# EAGLE design I2C LCD Backpack v28 (EAGLE 6.1)
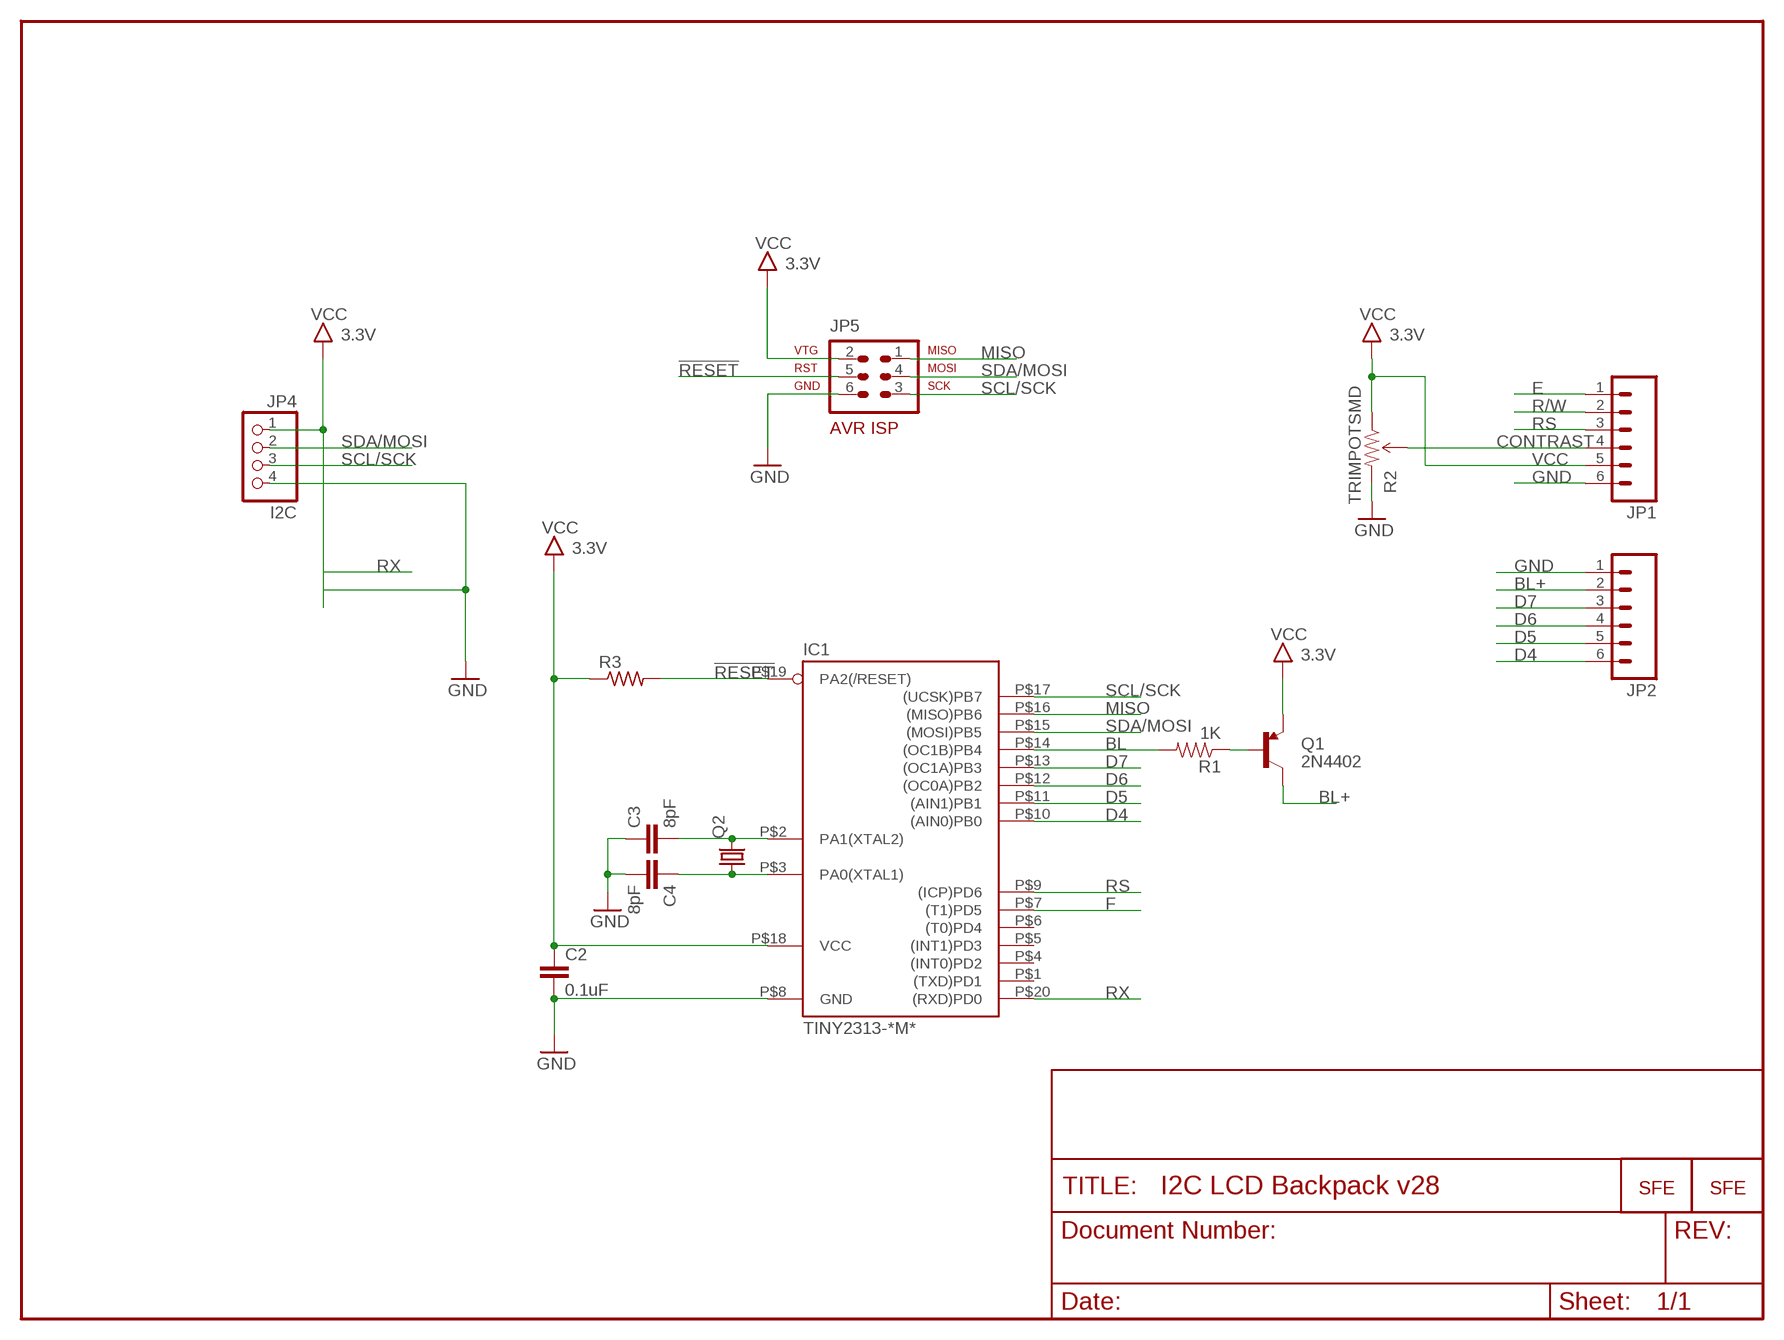
[diagram p0: schematic, sheet 1]

## Parts
C2  0.1uF  CAP0603-CAP  [0603-CAP]
C3  8pF  CAP0603-CAP  [0603-CAP]
C4  8pF  CAP0603-CAP  [0603-CAP]
IC1  TINY2313-*M*  [MLF20]
JP1  M06LOCK  [1X06_LOCK]
JP2  M06LOCK  [1X06_LOCK]
JP4  I2C  PINHD-1X04_2.54-S  [1X04-S]
JP5  AVR-ISP-6  [AVR-ISP-6]
Q1  2N4402  TRANSISTOR_PNPSMD  [SOT23-3]
Q2  CRYSTALNDK5X3  [NDK_2PAD_5X3]
R1  1K  RESISTOR0402-RES  [0402-RES]
R2  TRIMPOTSMD  [TRIMPOT-3MM]
R3  R-US_R0603  [R0603]
U$2  LOGO-FLAME-LARGE  [LOGO-FLAME-LARGE]
U$5  LOGO-SFENEW  [SFE-NEW-WEBLOGO]

## Nets
!RESET: IC1.P$19(PA2(/RESET)) JP5.5 R3.2
BL: IC1.P$14((OC1B)PB4) R1.2
BL+: JP2.2 Q1.3(C)
CONTRAST: JP1.4 R2.2(WIPER)
D4: IC1.P$10((AIN0)PB0) JP2.6
D5: IC1.P$11((AIN1)PB1) JP2.5
D6: IC1.P$12((OC0A)PB2) JP2.4
D7: IC1.P$13((OC1A)PB3) JP2.3
E: JP1.1
F: IC1.P$7((T1)PD5)
GND: C2.2 C3.1 C4.2 IC1.P$8(GND) JP1.6 JP2.1 JP4.4 JP5.6 R2.3(CW)
MISO: IC1.P$16((MISO)PB6) JP5.1
N$2: C4.1 IC1.P$3(PA0(XTAL1)) Q2.P$1
N$5: C3.2 IC1.P$2(PA1(XTAL2)) Q2.P$2
N$13: Q1.1(B) R1.1
R/W: JP1.2
RS: IC1.P$9((ICP)PD6) JP1.3
RX: IC1.P$20((RXD)PD0)
SCL/SCK: IC1.P$17((UCSK)PB7) JP4.3 JP5.3
SDA/MOSI: IC1.P$15((MOSI)PB5) JP4.2 JP5.4
VCC: C2.1 IC1.P$18(VCC) JP1.5 JP4.1 JP5.2 Q1.2(E) R2.1(CCW) R3.1 ; supply symbol labelled 3.3V
Unconnected: IC1.P$1((TXD)PD1) IC1.P$4((INT0)PD2) IC1.P$5((INT1)PD3) IC1.P$6((T0)PD4)

## Library data of the parts
C2-C4 = SparkFun:CAP: Capacitor Standard 0603 ceramic capacitor, and 0.1" leaded capacitor.
IC1 = avr-7:TINY2313*: Atmel Tiny2313 2K Flash, 128 bytes EEPROM, 128 bytes RAM
JP1 JP2 = SparkFun:M06: Header 6 Standard 6-pin 0.1" header. Use with straight break away headers (SKU : PRT-00116), right angle break away headers (PRT-00553), swiss pins (PRT-00743), machine pins (PRT-00117), and female headers (PRT-00115). Molex polarized connector foot print use with SKU : PRT-08094 with associated crimp pins and housings. NOTES ON THE VARIANTS LOCK and LOCK_LONGPADS... This footprint was designed to help hold the alignment of a through-hole component (i.e. 6-pin header) while soldering it into place. You may notice that each hole has been shifted either up or down by 0.005 of an inch from it's more standard position (which is a perfectly straight line). This slight alteration caused the pins (the squares in the middle) to touch the edges of the holes. Because they are alternating, it causes a "brace" to hold the component in place. 0.005 has proven to be the perfect amount of "off-center" position when using our standard breakaway headers. Although looks a little odd when you look at the bare footprint, once you have a header in there, the alteration is very hard to notice. Also, if you push a header all the way into place, it is covered up entirely on the bottom side. This idea of altering the position of holes to aid alignment will be further integrated into the Sparkfun Library for other footprints. It can help hold any component with 3 or more connection pins.
JP4 = pinhead-2:PINHD-1X04: PIN HEADER
JP5 = avr-4:AVR-ISP-6: AVR ISP-6 Serial Programming Header
Q1 = SparkFun:TRANSISTOR_PNP
Q2 = mes_crystal:CRYSTAL: CRYSTAL
R1 = SparkFun:RESISTOR: Resistor Basic schematic elements and footprints for 0603, 1206, and PTH 1/10th watt (small) resistors.
R2 = SparkFun:TRIMPOT
R3 = rcl:R-US_: RESISTOR, American symbol
U$2 = SparkFun:LOGO-FLAME-LARGE
U$5 = SparkFun:LOGO-SFE: Spark Fun Electronics PCB Logo This is the standard Spark Fun Electronics PCB logo.

## Board
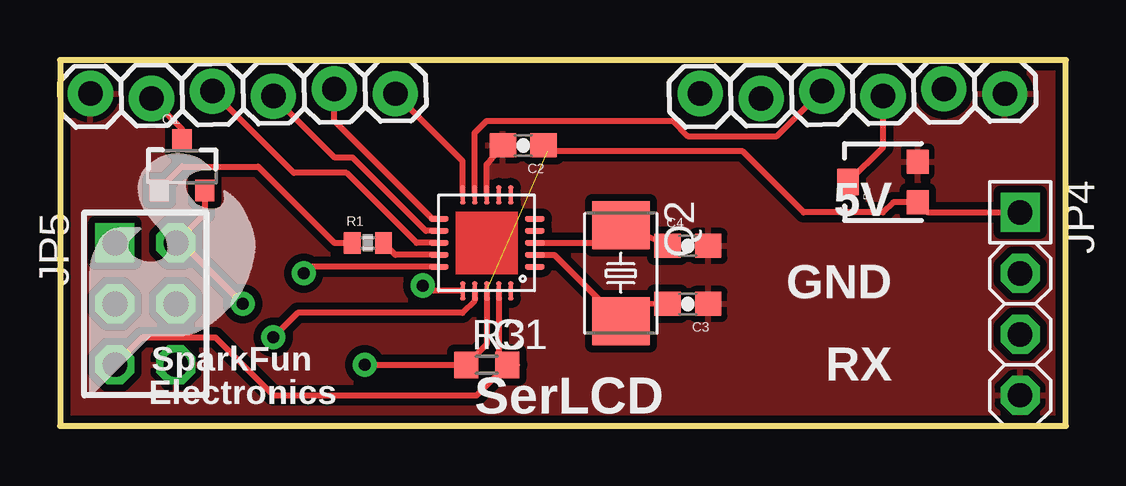
[diagram p1: board, top side]
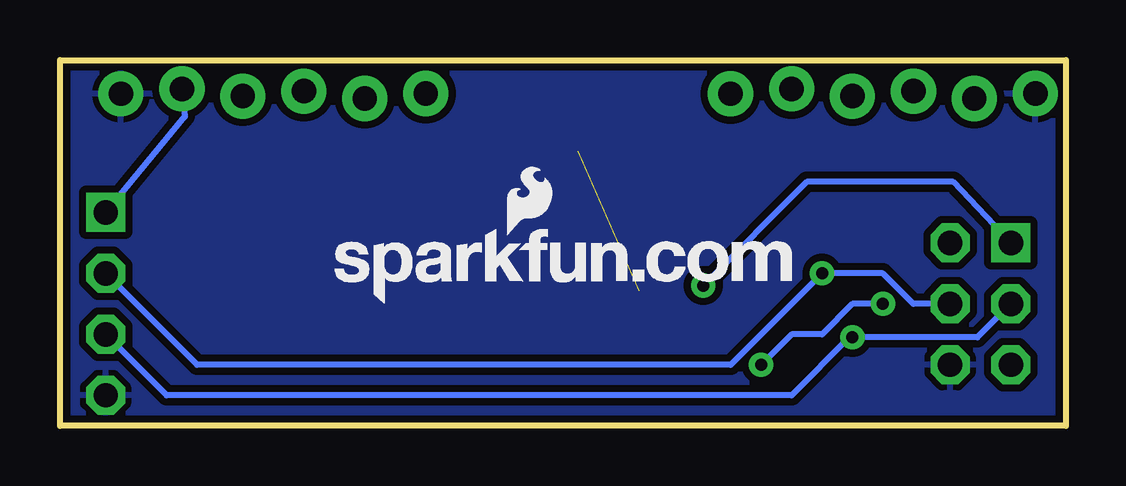
[diagram p2: board, bottom side, seen from below]

Size 41.91 x 15.24 mm. Coordinates in mm from the lower left corner, seen from the top.
Outline: 41.91,0 41.91,15.24 0,15.24 0,0 41.91,0
Copper layers (1*16): Top 0.035mm / dielectric 1.5mm / Bottom 0.035mm
Design rules: minimum track width 8mil, minimum drill 20mil, track to track 8mil, track to pad 8mil, pad to pad 8mil, via to via 8mil, smd to smd 8mil, copper to edge 10mil, drill to drill 8mil, minimum pad ring 12mil, minimum via ring 10mil, stop-mask expansion 4mil, vias tented up to drill 25mil, thermal gap 10mil

### Footprints (pad centres in the part's own frame; a part is rotated, then mirrored left to right if it is on the bottom)
0603-CAP = smd 1.1 x 1: 1 -0.85,0; 2 0.85,0
MLF20 = smd 0.8 x 0.23: P$1 -2,1; P$2 -2,0.5; P$3 -2,0; P$4 -2,-0.5; P$5 -2,-1; P$11 2,-1; P$12 2,-0.5; P$13 2,0; P$14 2,0.5; P$15 2,1 | smd 0.23 x 0.8: P$6 -1,-2; P$7 -0.5,-2; P$8 0,-2; P$9 0.5,-2; P$10 1,-2; P$16 1,2; P$17 0.5,2; P$18 0,2; P$19 -0.5,2; P$20 -1,2
1X06_LOCK = drill 1.016 pad 1.88: 1 0,0; 2 2.54,-0.254; 3 5.08,0; 4 7.62,-0.254; 5 10.16,0; 6 12.7,-0.254
1X04-S = drill 1.016 square: 1 -3.81,0 | drill 1.016 octagon: 2 -1.27,0; 3 1.27,0; 4 3.81,0
AVR-ISP-6 = drill 1.016 square: 1 -2.54,-1.27 | drill 1.016 octagon: 2 -2.54,1.27; 3 0,-1.27; 4 0,1.27; 5 2.54,-1.27; 6 2.54,1.27
SOT23-3 = smd 0.8 x 0.9: 1 -0.95,-1; 2 0.95,-1; 3 0,1.1
NDK_2PAD_5X3 = smd 2 x 2.4: P$1 -2,0; P$2 2,0
0402-RES = smd 0.7 x 0.9: 1 -0.65,0; 2 0.65,0
TRIMPOT-3MM = smd 1 x 0.9: 1 -0.85,-1.45; 3 0.85,-1.45 | smd 1.1 x 0.9: 2 0,1.45
R0603 = smd 1 x 1.1: 1 -0.85,0; 2 0.85,0

### Placement (x,y rotation side)
C2  19.3,11.68 180 top
C3  26.16,5.08 180 top
C4  26.16,7.49 0 top
IC1  17.78,7.62 180 top
JP1  26.67,13.84 1.1 top
JP2  1.27,13.84 1.1 top
JP4  40.01,5.08 270 top
JP5  3.56,5.08 270 top
Q1  5.08,10.79 0 top
Q2  23.37,6.35 270 top
R1  12.83,7.62 0 top
R2  34.29,10.16 90 top
R3  17.78,2.54 0 top
U$2  1.27,1.27 0 top
U$5  30.48,5.08 0 bottom

### Tracks (layer width: path | path; a pad name or v marks a point on that pad's centre or on a via)
!RESET
  Top 0.254: JP5.5 3.43,3.68 6.48,3.68 8.89,1.27 17.36,1.27 R3.2 | IC1.P$19 18.28,2.67 18.41,2.54 R3.2 | R3.2 19.05,2.54
BL
  Top 0.254: IC1.P$14 13.98,7.12 R1.2
BL+
  Top 0.254: Q1.3 5.08,12.37 JP2.2
CONTRAST
  Top 0.254: R2.2 34.29,11.61 JP1.4
D4
  Top 0.254: IC1.P$10 16.78,11.03 JP2.6
D5
  Top 0.254: IC1.P$11 15.51,8.62 11.43,12.7 JP2.5
D6
  Top 0.254: IC1.P$12 15.25,8.12 12.19,11.18 11.45,11.18 JP2.4
D7
  Top 0.254: IC1.P$13 14.86,7.62 11.94,10.54 9.75,10.54 JP2.3
GND
  Top 0.254: IC1.P$8 17.78,10.88 C2.2
  pour Bottom (isolate 0.305): 0,0 41.91,0 41.91,15.24 0,15.24
  pour Top (isolate 0.305): 0,0 41.91,0 41.91,15.24 0,15.24
MISO  (via drill 0.5)
  Top 0.254: IC1.P$16 15.34,5.62 v15.11,5.84
  Bottom 0.254: JP5.1 4.7,10.16 10.79,10.16 v15.11,5.84
N$2
  Top 0.254: IC1.P$3 22.35,7.62 23.37,8.64 Q2.P$1 24.44,7.91 C4.1
N$5
  Top 0.254: IC1.P$2 20.6,7.12 Q2.P$2 23.8,5.04 C3.2
N$13
  Top 0.254: 11.98,7.43 R1.1 | Q1.1 4.13,9.85 5.08,10.79 8.26,10.79 11.43,7.62 R1.1 | 12.19,7.62 R1.1
RS
  Top 0.254: IC1.P$9 17.28,12.2 17.78,12.7 25.53,12.7 26.16,12.06 29.87,12.06 JP1.3
SCL/SCK  (via drill 0.5)
  Top 0.254: IC1.P$17 17.28,5.21 16.76,4.7 9.91,4.7 v8.89,3.68
  Bottom 0.254: JP5.3 3.68,3.68 v8.89,3.68 9.02,3.68 11.43,1.27 37.47,1.27 JP4.3
SDA/MOSI  (via drill 0.5)
  Top 0.254: IC1.P$15 10.43,6.62 v10.16,6.35
  Bottom 0.254: JP5.4 6.35,5.08 7.62,6.35 v10.16,6.35 13.97,2.54 36.2,2.54 JP4.2
VCC  (via drill 0.5)  (1 unrouted)
  Top 0.254: Q1.2 6.03,8.82 JP5.2 5.08,7.62 v7.62,5.08 | IC1.P$18 17.78,3.39 R3.1 v12.7,2.54 | JP4.1 36.16,8.89 R2.1 34.71,9.31 34.29,8.89 30.99,8.89 28.45,11.43 20.32,11.43 20.15,11.6 C2.1
  Bottom 0.254: JP1.5 36.7,12.89 JP4.1 | v12.7,2.54 11.43,3.81 10.16,3.81 8.89,5.08 v7.62,5.08

### Text on the board
tPlace: 5V | GND | RX | SparkFun | Electronics | SerLCD